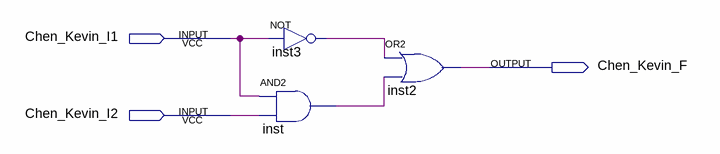
[diagram p0: schematic sheet]
// Quartus schematic Chen_Kevin_SimpleCircuit.bdf as structural Verilog: 3 symbols, 3 pins
module Chen_Kevin_SimpleCircuit (
  input  Chen_Kevin_I1,
  input  Chen_Kevin_I2,
  output Chen_Kevin_F
);

  wire inst3_out, inst_out;

  and inst (inst_out, Chen_Kevin_I1, Chen_Kevin_I2);
  not inst3 (inst3_out, Chen_Kevin_I1);
  or inst2 (Chen_Kevin_F, inst3_out, inst_out);
endmodule
